# Altium schematic sheet Block_Diagram.SchDoc
size A4; Date: 20.10.2024; Author: ismet akalın; DrawnBy: ismet akalın; SheetNumber: 2; SheetTotal: 5
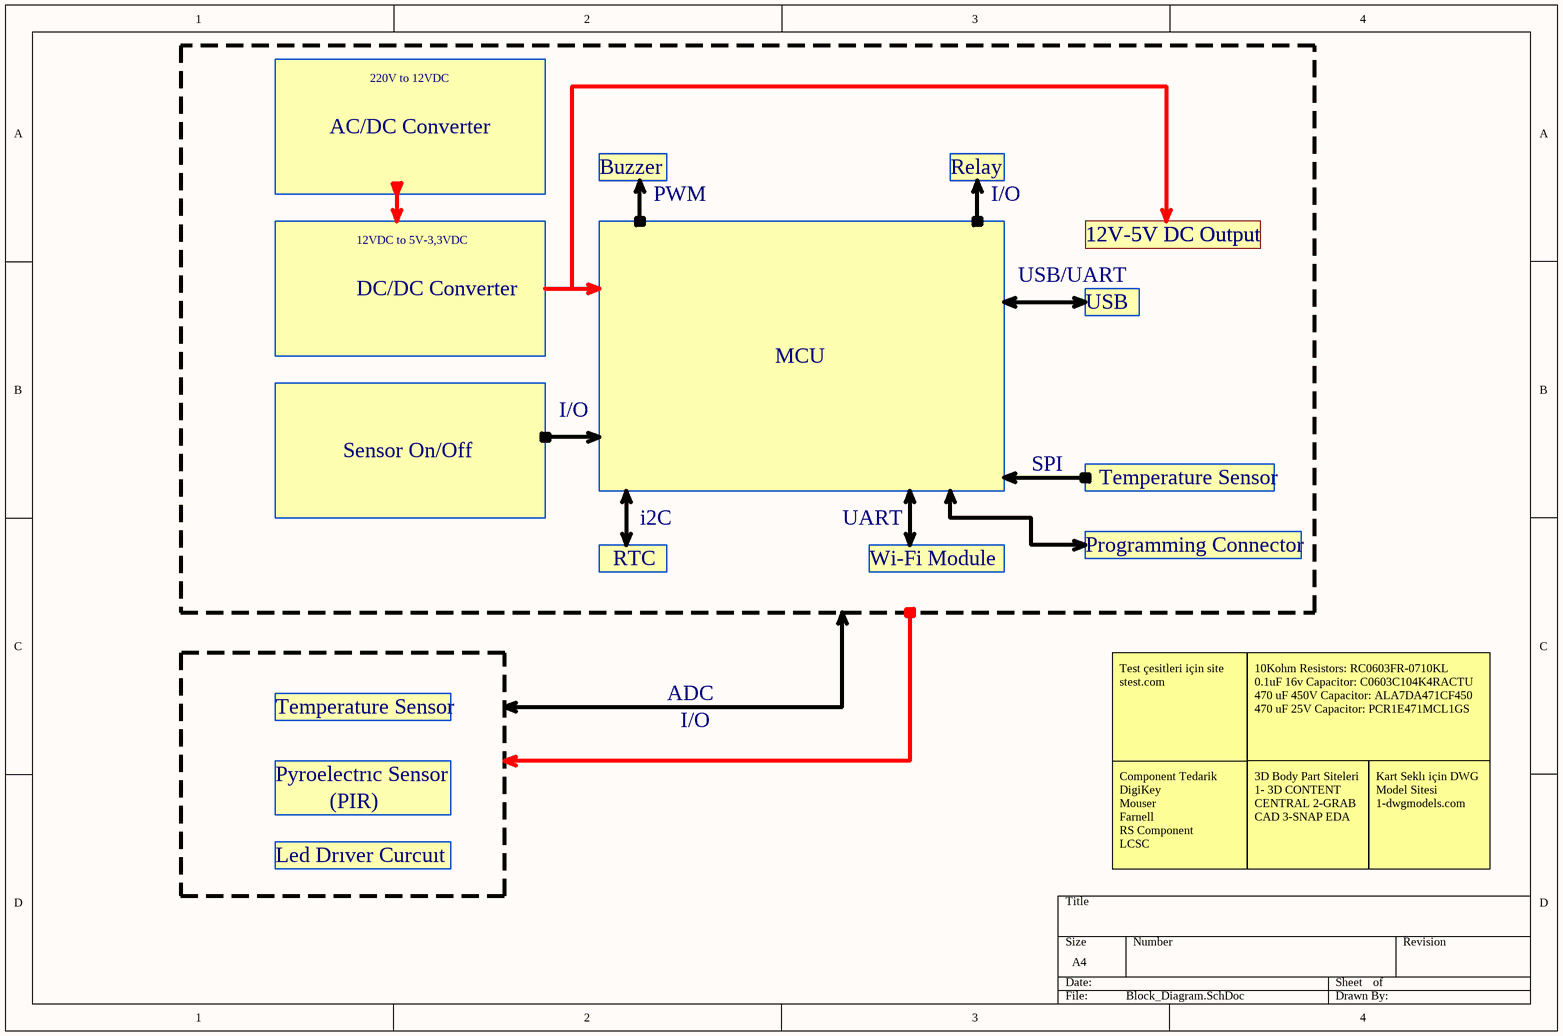
[diagram p0: Block_Diagram.SchDoc]

## Notes on the sheet
- 220V to 12VDC
- AC/DC Converter
- Buzzer
- Relay
- 12VDC to 5V-3,3VDC
- PWM
- I/O
- 12V-5V DC Output
- DC/DC Converter
- USB/UART
- USB
- MCU
- Sensor On/Off
- SPI
- Temperature Sensor
- RTC
- i2C
- UART
- Wi-Fi Module
- Programming Connector
- ADC
- Pyroelectrıc Sensor
- Test çesitleri için site         stest.com
- 10Kohm Resistors: RC0603FR-0710KL
  0.1uF 16v Capacitor: C0603C104K4RACTU
  470 uF 450V Capacitor: ALA7DA471CF450
  470 uF 25V Capacitor: PCR1E471MCL1GS
- (PIR)
- Led Drıver Curcuıt
- Component Tedarik
  DigiKey
  Mouser
  Farnell
  RS Component
  LCSC
- 3D Body Part Siteleri  1- 3D CONTENT CENTRAL 2-GRAB CAD 3-SNAP EDA
- Kart Seklı için DWG Model Sitesi 1-dwgmodels.com